# Altium schematic sheet Sheet1.SchDoc
size A4
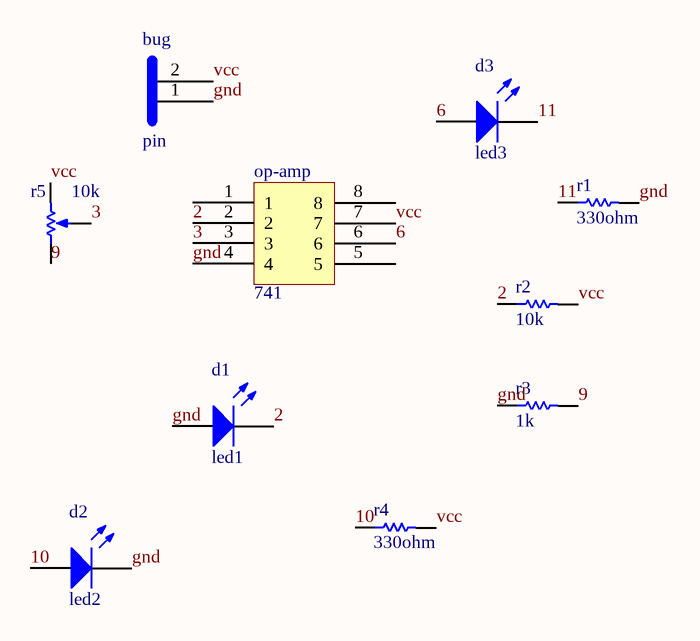
[diagram p0: Sheet1.SchDoc]

## Parts
bug  pin  [bergstrip-2pin]
d1  led1  [LED-BLUE]
d2  led2  [LED-BLUE]
d3  led3  [LED-BLUE]
op-amp  741  [dip-8pin]
r1  330ohm  [res-2.54x4]
r2  10k  [res-2.54x4]
r3  1k  [res-2.54x4]
r4  330ohm  [res-2.54x4]
r5  10k  [reg-variable]

## Nets
2: d1.2(K) op-amp.2 r2.1
3: op-amp.3 r5.3(TAP)
6: d3.1(A) op-amp.6
9: r3.2 r5.1(TOP)
10: d2.1(A) r4.1
11: d3.2(K) r1.1
gnd: bug.1 d1.1(A) d2.2(K) op-amp.4 r1.2 r3.1
vcc: bug.2 op-amp.7 r2.2 r4.2 r5.2(BOT)

Not connected (* = marked no-connect by the designer): op-amp 1 5 8

## Library data of the parts
bug = BURG STRIP 2
d1-d3 = LED-BLUE: Typical BLUE SiC LED; Published: 8-Jun-2000; LatestRevisionDate: 17-Dec-2003; LatestRevisionNote: PCB Footprint replaced.; DatasheetVersion: 16-Apr-2002; PackageVersion: 16-Apr-2002; PackageReference: 3.5X2.8X1.9; Publisher: Altium Limited
op-amp = dip-8pin
r1-r4 = Resistor 2.54x4
r5 = Variable Resistor